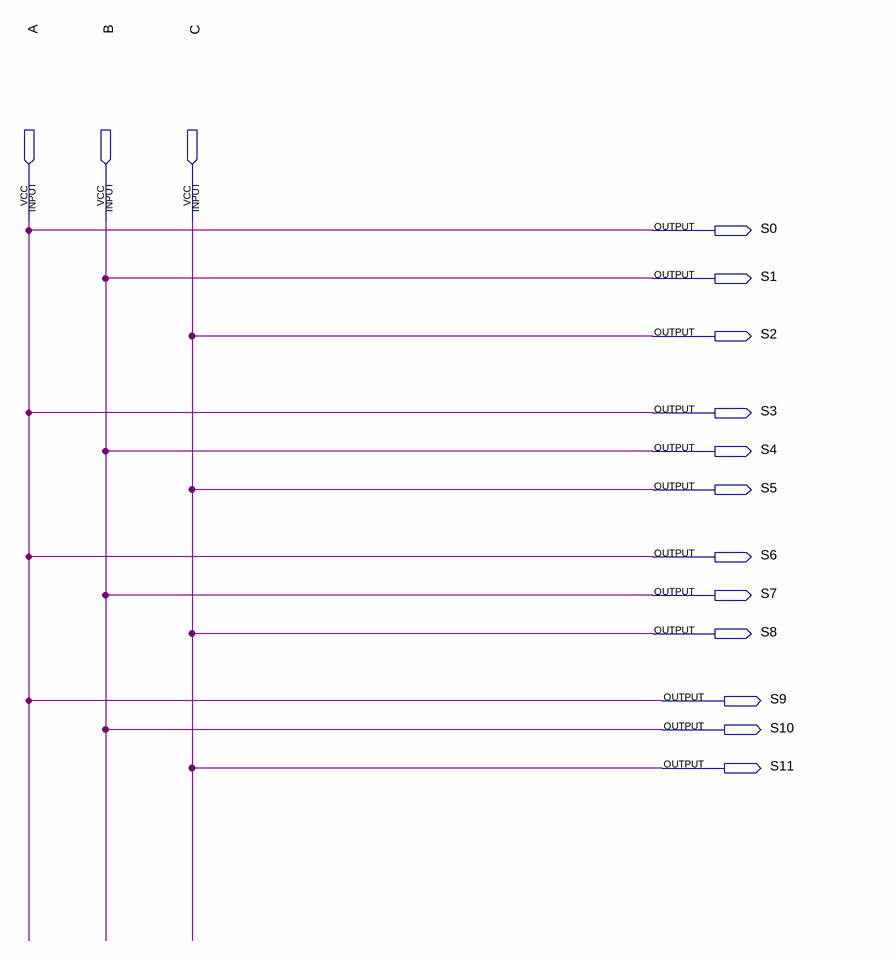
[diagram p0: schematic sheet]
// Quartus schematic Demux.bdf as structural Verilog: 0 symbols, 15 pins
module Demux (
  input  A,
  input  B,
  input  C,
  output S0,
  output S1,
  output S2,
  output S3,
  output S4,
  output S5,
  output S6,
  output S7,
  output S8,
  output S9,
  output S10,
  output S11
);


  assign S0 = A;
  assign S1 = B;
  assign S2 = C;
  assign S3 = A;
  assign S4 = B;
  assign S5 = C;
  assign S6 = A;
  assign S7 = B;
  assign S8 = C;
  assign S9 = A;
  assign S10 = B;
  assign S11 = C;
endmodule
